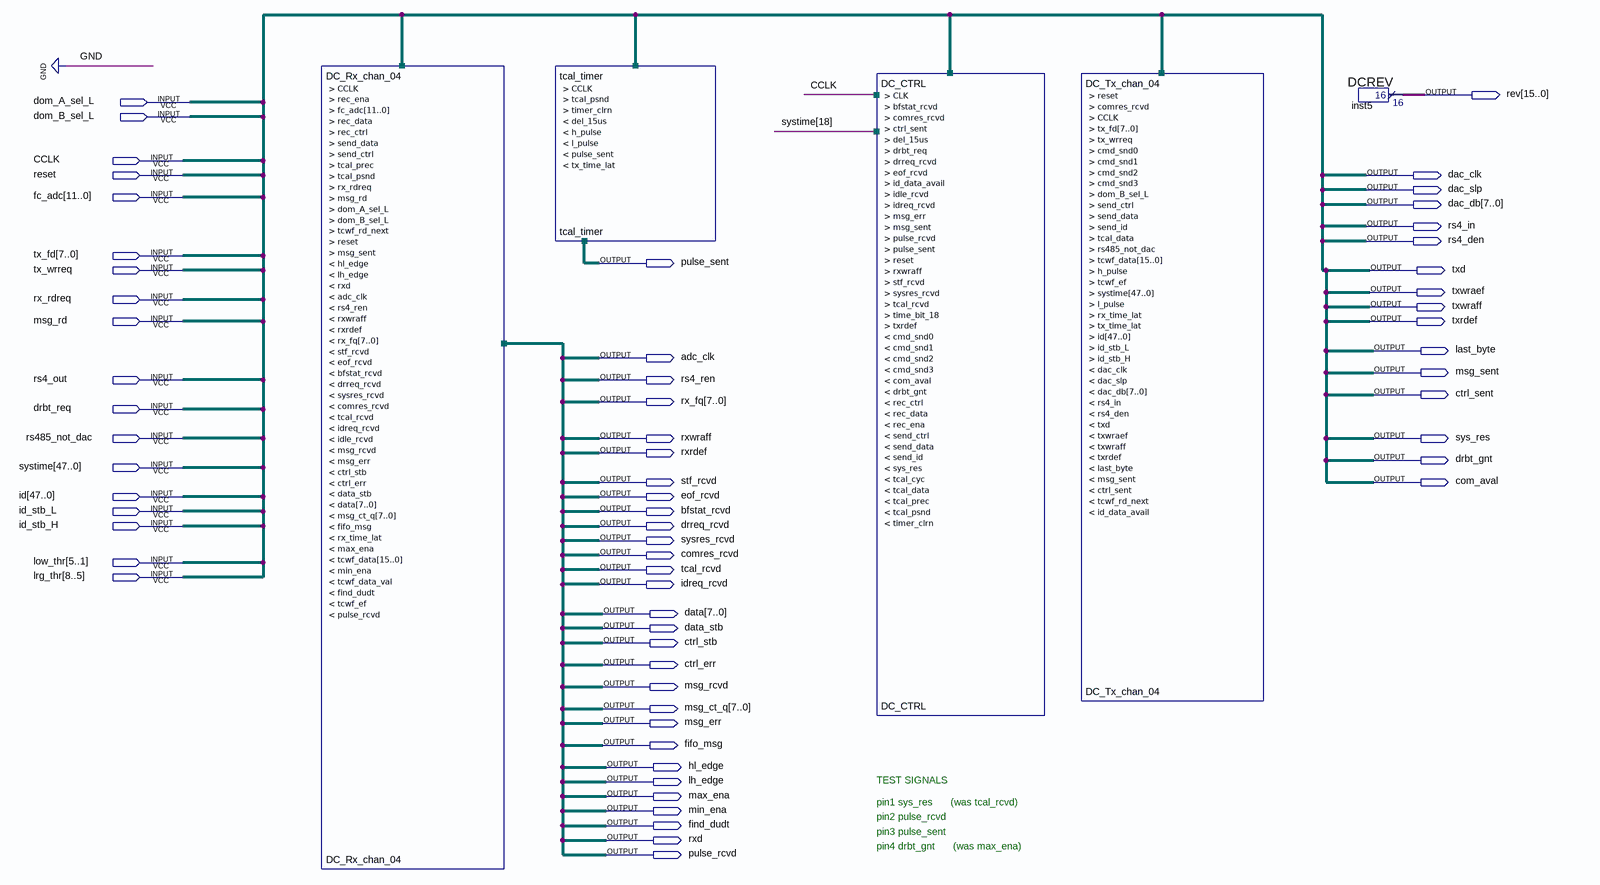
[diagram p0: schematic sheet]
// Quartus schematic dcom_dpr.bdf as structural Verilog: 5 symbols, 63 pins
module dcom_dpr (
  input  dom_A_sel_L,
  input  dom_B_sel_L,
  input  CCLK,
  input  reset,
  input  [11:0] fc_adc,
  input  [7:0] tx_fd,
  input  tx_wrreq,
  input  rx_rdreq,
  input  msg_rd,
  input  rs4_out,
  input  drbt_req,
  input  rs485_not_dac,
  input  [47:0] systime,
  input  [47:0] id,
  input  id_stb_L,
  input  id_stb_H,
  input  [5:1] low_thr,
  input  [8:5] lrg_thr,
  output [15:0] rev,
  output dac_clk,
  output dac_slp,
  output [7:0] dac_db,
  output rs4_in,
  output rs4_den,
  output pulse_sent,
  output txd,
  output txwraef,
  output txwraff,
  output txrdef,
  output last_byte,
  output adc_clk,
  output msg_sent,
  output rs4_ren,
  output ctrl_sent,
  output [7:0] rx_fq,
  output rxwraff,
  output sys_res,
  output rxrdef,
  output drbt_gnt,
  output stf_rcvd,
  output com_aval,
  output eof_rcvd,
  output bfstat_rcvd,
  output drreq_rcvd,
  output sysres_rcvd,
  output comres_rcvd,
  output tcal_rcvd,
  output idreq_rcvd,
  output [7:0] data,
  output data_stb,
  output ctrl_stb,
  output ctrl_err,
  output msg_rcvd,
  output [7:0] msg_ct_q,
  output msg_err,
  output fifo_msg,
  output hl_edge,
  output lh_edge,
  output max_ena,
  output min_ena,
  output find_dudt,
  output rxd,
  output pulse_rcvd
);

  wire cmd_snd0, cmd_snd1, cmd_snd2, cmd_snd3, del_15us, h_pulse, id_data_avail, idle_rcvd, l_pulse,
       rec_ctrl, rec_data, rec_ena, rx_time_lat, send_ctrl, send_data, send_id, tcal_data, tcal_prec,
       tcal_psnd, tcwf_ef, tcwf_rd_next, timer_clrn, tx_time_lat;
  wire [15:0] tcwf_data;

  DC_Rx_chan_04 DC_Rx_chan_04 (
    .CCLK(CCLK), .rec_ena(rec_ena), .fc_adc(fc_adc), .rec_data(rec_data), .rec_ctrl(rec_ctrl),
    .send_data(send_data), .send_ctrl(send_ctrl), .tcal_prec(tcal_prec), .tcal_psnd(tcal_psnd),
    .rx_rdreq(rx_rdreq), .msg_rd(msg_rd), .dom_A_sel_L(dom_A_sel_L), .dom_B_sel_L(dom_B_sel_L),
    .tcwf_rd_next(tcwf_rd_next), .reset(reset), .msg_sent(msg_sent), .hl_edge(hl_edge), .lh_edge(lh_edge),
    .rxd(rxd), .adc_clk(adc_clk), .rs4_ren(rs4_ren), .rxwraff(rxwraff), .rxrdef(rxrdef), .rx_fq(rx_fq),
    .stf_rcvd(stf_rcvd), .eof_rcvd(eof_rcvd), .bfstat_rcvd(bfstat_rcvd), .drreq_rcvd(drreq_rcvd),
    .sysres_rcvd(sysres_rcvd), .comres_rcvd(comres_rcvd), .tcal_rcvd(tcal_rcvd), .idreq_rcvd(idreq_rcvd),
    .idle_rcvd(idle_rcvd), .msg_rcvd(msg_rcvd), .msg_err(msg_err), .ctrl_stb(ctrl_stb), .ctrl_err(ctrl_err),
    .data_stb(data_stb), .data(data), .msg_ct_q(msg_ct_q), .fifo_msg(fifo_msg), .rx_time_lat(rx_time_lat),
    .max_ena(max_ena), .tcwf_data(tcwf_data), .min_ena(min_ena), .find_dudt(find_dudt), .tcwf_ef(tcwf_ef),
    .pulse_rcvd(pulse_rcvd));  // open: tcwf_data_val
  tcal_timer tcal_timer (
    .CCLK(CCLK), .tcal_psnd(tcal_psnd), .timer_clrn(timer_clrn), .del_15us(del_15us), .h_pulse(h_pulse),
    .l_pulse(l_pulse), .pulse_sent(pulse_sent), .tx_time_lat(tx_time_lat));
  DC_CTRL DC_CTRL (
    .CLK(CCLK), .bfstat_rcvd(bfstat_rcvd), .comres_rcvd(comres_rcvd), .ctrl_sent(ctrl_sent),
    .del_15us(del_15us), .drbt_req(drbt_req), .drreq_rcvd(drreq_rcvd), .eof_rcvd(eof_rcvd),
    .id_data_avail(id_data_avail), .idle_rcvd(idle_rcvd), .idreq_rcvd(idreq_rcvd), .msg_err(msg_err),
    .msg_sent(msg_sent), .pulse_rcvd(pulse_rcvd), .pulse_sent(pulse_sent), .reset(reset), .rxwraff(rxwraff),
    .stf_rcvd(stf_rcvd), .sysres_rcvd(sysres_rcvd), .tcal_rcvd(tcal_rcvd), .time_bit_18(systime[18]),
    .txrdef(txrdef), .cmd_snd0(cmd_snd0), .cmd_snd1(cmd_snd1), .cmd_snd2(cmd_snd2), .cmd_snd3(cmd_snd3),
    .com_aval(com_aval), .drbt_gnt(drbt_gnt), .rec_ctrl(rec_ctrl), .rec_data(rec_data), .rec_ena(rec_ena),
    .send_ctrl(send_ctrl), .send_data(send_data), .send_id(send_id), .sys_res(sys_res),
    .tcal_data(tcal_data), .tcal_prec(tcal_prec), .tcal_psnd(tcal_psnd), .timer_clrn(timer_clrn));  // open: tcal_cyc
  DC_Tx_chan_04 DC_Tx_chan_04 (
    .reset(reset), .comres_rcvd(comres_rcvd), .CCLK(CCLK), .tx_fd(tx_fd), .tx_wrreq(tx_wrreq),
    .cmd_snd0(cmd_snd0), .cmd_snd1(cmd_snd1), .cmd_snd2(cmd_snd2), .cmd_snd3(cmd_snd3),
    .dom_B_sel_L(dom_B_sel_L), .send_ctrl(send_ctrl), .send_data(send_data), .send_id(send_id),
    .tcal_data(tcal_data), .rs485_not_dac(rs485_not_dac), .tcwf_data(tcwf_data), .h_pulse(h_pulse),
    .tcwf_ef(tcwf_ef), .systime(systime), .l_pulse(l_pulse), .rx_time_lat(rx_time_lat),
    .tx_time_lat(tx_time_lat), .id(id), .id_stb_L(id_stb_L), .id_stb_H(id_stb_H), .dac_clk(dac_clk),
    .dac_slp(dac_slp), .dac_db(dac_db), .rs4_in(rs4_in), .rs4_den(rs4_den), .txd(txd), .txwraef(txwraef),
    .txwraff(txwraff), .txrdef(txrdef), .last_byte(last_byte), .msg_sent(msg_sent), .ctrl_sent(ctrl_sent),
    .tcwf_rd_next(tcwf_rd_next), .id_data_avail(id_data_avail));
  DCREV inst5 (.result(rev));

  // Notes on the sheet:
  //   TEST SIGNALS
  //   pin1 sys_res      (was tcal_rcvd)
  //   pin2 pulse_rcvd
  //   pin3 pulse_sent
  //   pin4 drbt_gnt      (was max_ena)
endmodule
